# Altium schematic sheet MP28167GQ-Z_Buck-Boost Switching Regulator.SchDoc: +5 Output DC-DC Converter
size A4
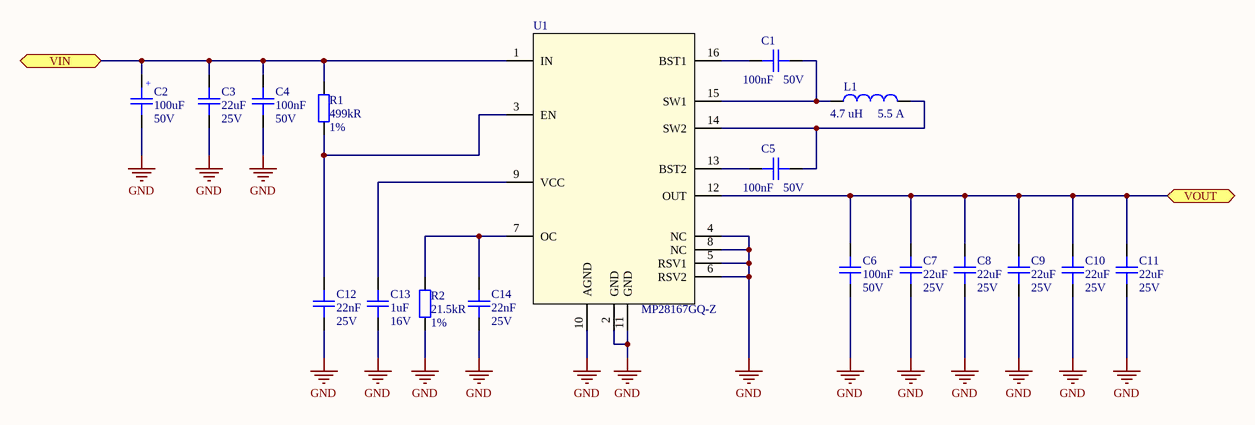
[diagram p0: MP28167GQ-Z_Buck-Boost Switching Regulator.SchDoc]

## Parts
C1  Capacitance: 100nF  Voltage: 50V  [C0402]  (hidden comment: CAP CER 0.1UF 50V X7R 0402)
C2  Capacitance: 100uF  Rated Voltage: 50V  [WCAP-ASLI_8.3X10.5]  (hidden comment: CAP ALUM 100UF 20% 50V SMD)
C3  Capacitance: 22uF  Voltage Rating: 25V  [C0805]  (hidden comment: CAP CER 22UF 25V X5R 0805)
C4  Capacitance: 100nF  Voltage: 50V  [C0402]  (hidden comment: CAP CER 0.1UF 50V X7R 0402)
C5  Capacitance: 100nF  Voltage: 50V  [C0402]  (hidden comment: CAP CER 0.1UF 50V X7R 0402)
C6  Capacitance: 100nF  Voltage: 50V  [C0402]  (hidden comment: CAP CER 0.1UF 50V X7R 0402)
C7  Capacitance: 22uF  Voltage Rating: 25V  [C0805]  (hidden comment: CAP CER 22UF 25V X5R 0805)
C8  Capacitance: 22uF  Voltage Rating: 25V  [C0805]  (hidden comment: CAP CER 22UF 25V X5R 0805)
C9  Capacitance: 22uF  Voltage Rating: 25V  [C0805]  (hidden comment: CAP CER 22UF 25V X5R 0805)
C10  Capacitance: 22uF  Voltage Rating: 25V  [C0805]  (hidden comment: CAP CER 22UF 25V X5R 0805)
C11  Capacitance: 22uF  Voltage Rating: 25V  [C0805]  (hidden comment: CAP CER 22UF 25V X5R 0805)
C12  Capacitance: 22nF  Voltage Rating: 25V  [C0402]  (hidden comment: CAP CER 0.022UF 25V X7R 0402)
C13  Capacitance: 1uF  Voltage Rating: 16V  [C0402]  (hidden comment: CAP CER 1UF 16V X5R 0402)
C14  Capacitance: 22nF  Voltage Rating: 25V  [C0402]  (hidden comment: CAP CER 0.022UF 25V X7R 0402)
L1  Inductance: 4.7 uH  Maximum DC Current: 5.5 A  [IND_WE_MAPI]  (hidden comment: FIXED IND 4.7UH 5.5A 34.5MOHM SM)
R1  Resistance: 499kR  Tolerance: 1%  [R0402]  (hidden comment: RES SMD 499K OHM 1% 1/16W 0402)
R2  Resistance: 21.5kR  Tolerance: 1%  [R0402]  (hidden comment: RES SMD 21.5K OHM 1% 1/16W 0402)
U1  MP28167GQ-Z  [QFN16_3X3]

## Ports
VIN, VOUT

## Nets
GND: C2.2 C3.1 C4.1 C6.1 C7.1 C8.1 C9.1 C10.1 C11.1 C12.1 C13.1 C14.1 R2.2 U1.2(GND) U1.4(NC) U1.5(RSV1) U1.6(RSV2) U1.8(NC) U1.10(AGND) U1.11(GND)
VIN: C2.1 C3.2 C4.2 R1.2 U1.1(IN) ; port VIN
VOUT: C6.2 C7.2 C8.2 C9.2 C10.2 C11.2 U1.12(OUT) ; port VOUT
NetC1_1: C1.1 U1.16(BST1)
NetC1_2: C1.2 L1.1 U1.15(SW1)
NetC5_1: C5.1 U1.13(BST2)
NetC5_2: C5.2 L1.2 U1.14(SW2)
NetC12_2: C12.2 R1.1 U1.3(EN)
NetC13_2: C13.2 U1.9(VCC)
NetC14_2: C14.2 R2.1 U1.7(OC)

## Notes on the sheet
- Title
- Size:
- Date:
- A4
- Number:
- Time:
- Revision:
- Sheet
- of
- File:
- (in symbol CAP ALUM 100UF 20% 50V SMD) +

## Library data of the parts
C1 C4-C6 = CAP CER 0.1UF 50V X7R 0402: 0.1µF ±10% 50V Ceramic Capacitor X7R 0402 (1005 Metric); Manufacturer: TDK; Manufacturer Part Number: CGA2B3X7R1H104K050BB; Supplier 1: Digi-Key; Stock 1: 2925303; Pricing 1: 1=0.17, 10=0.118, 50=0.0668, 100=0.0553, 500=0.0388, 1000=0.0321, 2500=0.0299, 5000=0.0273 (USD); Mount: Surface Mount; Case/Package: 0402; Weight: 2.3E-05oz; Case Code (Metric): 1005; Case Code (Imperial): 0402; Min Operating Temperature: -55°C; Max Operating Temperature: 125°C; Voltage Rating: 50V; Tolerance: 10%; Packaging: Tape and Reel; Package Quantity: 1; Voltage Rating (DC): 50V; Dielectric: X7R; Termination: SMD/SMT; Composition: Ceramic; Length: 1mm; Height: 0.5mm; Width: 0.02inch; Thickness: 0.022inch; Depth: 0.5mm; Ratings: AEC-Q200; REACH SVHC: No SVHC; Lead Free: Lead Free; ComponentLink1URL: http://product.tdk.com/capacitor/mlcc/en/documents/mlccspec_automotive_general_midvoltage_en.pdf?src-supplier=Future+Electronics; ComponentLink1Description: http://product.tdk.com/capacitor/mlcc/en/documents/mlccspec_automotive_general_midvoltage_en.pdf?src-supplier=Future+Electronics; ComponentLink2URL: http://www.farnell.com/datasheets/1807242.pdf?src-supplier=Element14; ComponentLink2Description: http://www.farnell.com/datasheets/1807242.pdf?src-supplier=Element14; ComponentLink3URL: http://www.mouser.com/ds/2/400/lcc_automotive_general_en-843974.pdf?src-supplier=Mouser; ComponentLink3Description: http://www.mouser.com/ds/2/400/lcc_automotive_general_en-843974.pdf?src-supplier=Mouser; ComponentLink4URL: http://www.farnell.com/datasheets/1936565.pdf?src-supplier=Element14; ComponentLink4Description: http://www.farnell.com/datasheets/1936565.pdf?src-supplier=Element14; ComponentLink5URL: http://www.farnell.com/datasheets/1735392.pdf?src-supplier=Element14; ComponentLink5Description: http://www.farnell.com/datasheets/1735392.pdf?src-supplier=Element14; Supplier Part Number 1: 445-6899-1-ND
C2 = CAP ALUM 100UF 20% 50V SMD: 100 µF 50 V Aluminum Electrolytic Capacitors Radial, Can - SMD - 2000 Hrs @ 105°C; Manufacturer: Wurth Elektronik; Manufacturer Part Number: 865080653016; Dissipation Factor: 10%; Endurance: 2000h; Capacitance Tolerance: +/-20%; Supplier 1: Digi-Key; Packaging: Tape and Reel; ComponentLink1URL: http://www.we-online.de; ComponentLink1Description: Manufacturer; Supplier Part Number 1: 732-8461-2-ND; Diameter: 8mm; Height: 10.5mm; ComponentLink2URL: https://www.we-online.com/catalog/datasheet/865080443009.pdf; ComponentLink2Description: Datasheet; Mounting Technology: SMT; Operating Temperature: -55 to +105degC; Published Date: May 2020; Mount: Surface Mount
C3 C7-C11 = CAP CER 22UF 25V X5R 0805: 22µF ±20% 25V Ceramic Capacitor X5R 0805 (2012 Metric); Manufacturer: Yageo; Manufacturer Part Number: CC0805MKX5R8BB226; Supplier 1: Digi-Key; Stock 1: 1060; Pricing 1: 1=0.5, 10=0.353, 50=0.267, 100=0.2325, 500=0.1722, 1000=0.1464 (USD); Mount: Surface Mount; Case/Package: 0805; Weight: 0.000194oz; Case Code (Metric): 2012; Case Code (Imperial): 0805; Min Operating Temperature: -55°C; Max Operating Temperature: 85°C; Packaging: Tape and Reel; Tolerance: 20%; Dielectric: X5R; Termination: SMD/SMT; Voltage Rating (DC): 25V; Package Quantity: 3000; Length: 0.079inch; Height: 1.25mm; Width: 0.049inch; Thickness: 0.057inch; Lead Free: Lead Free; Halogen Free: Halogen Free; ComponentLink1URL: http://www.yageo.com/documents/recent/UPY-GPHC_X5R_4V-to-50V_25.pdf?src-supplier=Digi-Key; ComponentLink1Description: http://www.yageo.com/documents/recent/UPY-GPHC_X5R_4V-to-50V_25.pdf?src-supplier=Digi-Key; ComponentLink2URL: http://www.mouser.com/ds/2/447/Yageo_UPY-GP_NP0_16V-to-50V_9-358835.pdf?src-supplier=Mouser; ComponentLink2Description: http://www.mouser.com/ds/2/447/Yageo_UPY-GP_NP0_16V-to-50V_9-358835.pdf?src-supplier=Mouser; Supplier Part Number 1: 311-1903-1-ND
C12 C14 = CAP CER 0.022UF 25V X7R 0402: 0.022µF ±10% 25V Ceramic Capacitor X7R 0402 (1005 Metric); Manufacturer: TDK; Manufacturer Part Number: CGA2B2X7R1E223K050BA; Supplier 1: Digi-Key; Stock 1: 330320; Pricing 1: 1=0.1, 10=0.057, 50=0.0312, 100=0.0255, 500=0.0182, 1000=0.0143, 2500=0.013, 5000=0.012 (USD); Mount: Surface Mount; Case/Package: 0402; Weight: 2.3E-05oz; Case Code (Imperial): 0402; Case Code (Metric): 1005; Min Operating Temperature: -55°C; Max Operating Temperature: 125°C; Voltage Rating (DC): 25V; Tolerance: 10%; Packaging: Tape and Reel; Package Quantity: 1; Dielectric: X7R; Termination: SMD/SMT; Composition: Ceramic; Length: 1mm; Height: 0.5mm; Width: 0.5mm; Thickness: 0.022inch; Depth: 0.5mm; Ratings: AEC-Q200; REACH SVHC: No SVHC; ComponentLink1URL: http://www.mouser.com/ds/2/400/lcc_automotive_general_en-843974.pdf?src-supplier=Mouser; ComponentLink1Description: http://www.mouser.com/ds/2/400/lcc_automotive_general_en-843974.pdf?src-supplier=Mouser; Supplier Part Number 1: 445-5609-1-ND
C13 = CAP CER 1UF 16V X5R 0402: 1µF ±10% 16V Ceramic Capacitor X5R 0402 (1005 Metric); Manufacturer: Yageo; Manufacturer Part Number: CC0402KRX5R7BB105; Supplier 1: Digi-Key; Stock 1: 1114963; Pricing 1: 1=0.4, 10=0.278, 100=0.167, 500=0.1253, 1000=0.1058, 2500=0.1002, 5000=0.0947 (USD); Mount: Surface Mount; Case/Package: 0402; Weight: 2.3E-05oz; Case Code (Metric): 1005; Case Code (Imperial): 0402; Min Operating Temperature: -55°C; Max Operating Temperature: 85°C; Packaging: Tape and Reel; Tolerance: 10%; Voltage Rating (DC): 16V; Dielectric: X5R; Termination: SMD/SMT; Length: 1mm; Height: 0.5mm; Width: 0.02inch; Thickness: 0.022inch; Depth: 0.5mm; Lead Free: Lead Free; ComponentLink1URL: http://www.yageo.com/documents/recent/UPY-GPHC_X5R_4V-to-50V_12.pdf?src-supplier=Avnet+Europe; ComponentLink1Description: http://www.yageo.com/documents/recent/UPY-GPHC_X5R_4V-to-50V_12.pdf?src-supplier=Avnet+Europe; Supplier Part Number 1: 311-1691-1-ND; Composition: Ceramic; Radiation Hardening: No; Halogen Free: Halogen Free
L1 = FIXED IND 4.7UH 5.5A 34.5MOHM SM: Manufacturer: Wurth Elektronik; Manufacturer Part Number: 74438367047; Self Resonant Frequency: 18.5 MHz; Shielding: Shielded; Tolerance: 20 %; RoHS: RoHS Compliant; Category: Fixed Inductors; Stock 1: 2000; Pricing 1: 1=0.730, 10=0.721, 50=0.601, 100=0.457, 1000=0.397, 2000=0.385 (USD); Application: Power; Height: 3.1 mm; Length: 5.4 mm; Maximum DC Resistance: 34.5 mOhms; Packaging: Cut Tape; Product: Fixed Inductors; Series: WE-MAPI; Termination Style: SMD/SMT; Width: 5.4 mm; Brand: Wurth Elektronik; Mounting Style: PCB Mount; Maximum Operating Temperature: + 125 C; Minimum Operating Temperature: - 40 C; Product Type: Fixed Inductors; Saturation Current: 5.5 A; Standard Pack Qty: 700; Subcategory: Inductors, Chokes & Coils; Termination: -; RoHS - Mouser: Y; Minimum Order Quantity: 1; Reeling: True; ComponentLink1URL: https://www.digikey.com/en/products/detail/würth-elektronik/74438367047/11657931?s=N4IgjCBcoMxaBjKAzAhgGwM4FMA0IB7KAbXAE4AGCkAXXwAcAXKEAZUYCcBLAOwHMQAX3wA2MvBBJIaLHkIkQAFgpkYq2g2aQ2nXgOHgATGHHRJKDDnxFIpQzHtgRGkExbtu-IfkMUAHADsElIyVvK2SgB0AQAEAK0AEi5u2gCqPFyMAPLIALLYqJgArhzY3iAAtBBmIZZyNqQBDrQGFYbBUJxF9QoArC2CgkA; ComponentLink1Description: https://www.digikey.com/en/products/detail/würth-elektronik/74438367047/11657931?s=N4IgjCBcoMxaBjKAzAhgGwM4FMA0IB7KAbXAE4AGCkAXXwAcAXKEAZUYCcBLAOwHMQAX3wA2MvBBJIaLHkIkQAFgpkYq2g2aQ2nXgOHgATGHHRJKDDnxFIpQzHtgRGkExbtu-IfkMUAHADsElIyVvK2SgB0AQAEAK0AEi5u2gCqPFyMAPLIALLYqJgArhzY3iAAtBBmIZZyNqQBDrQGFYbBUJxF9QoArC2CgkA; Supplier 2: Digi-Key; Supplier Part Number 1: 732-74438367047TR-ND; Mount: Surface Mount
R1 = RES SMD 499K OHM 1% 1/16W 0402: 499 kOhms ±1% 0.063W, 1/16W Chip Resistor 0402 (1005 Metric) Moisture Resistant Thick Film; Manufacturer: Yageo; Manufacturer Part Number: RC0402FR-07499KL; Power Rating: 62.5mW; Voltage Rating: 50V; Temperature Coefficient: 100ppm/°C; Max Power Dissipation: 63mW; Supplier 1: Digi-Key; Stock 1: 118017; Pricing 1: 1=0.1, 10=0.016, 100=0.0064, 1000=0.0029, 2500=0.0025, 5000=0.0021 (USD); Case/Package: 0402; Weight: 2.3E-05oz; Case Code (Imperial): 0402; Case Code (Metric): 1005; Min Operating Temperature: -55°C; Max Operating Temperature: 155°C; Packaging: Tape and Reel; Composition: Thick Film; Number of Terminations: 2; Termination: SMD/SMT; Military Standard: Not; Features: Moisture Resistant; Length: 1mm; Height: 0.016inch; Width: 0.02inch; Depth: 0.5mm; REACH SVHC: Unknown; Lead Free: Lead Free; ComponentLink1URL: https://www.digikey.com/en/products/detail/yageo/RC0402FR-07499KL/726622?s=N4IgTCBcDaIEoGEAMAWJYBicC0SDsKAnIQNIAyIAugL5A; ComponentLink1Description: https://www.digikey.com/en/products/detail/yageo/RC0402FR-07499KL/726622?s=N4IgTCBcDaIEoGEAMAWJYBicC0SDsKAnIQNIAyIAugL5A; Supplier Part Number 1: 311-499KLRTR-ND; Mount: Surface Mount
R2 = RES SMD 21.5K OHM 1% 1/16W 0402: 21.5 kOhms ±1% 0.063W, 1/16W Chip Resistor 0402 (1005 Metric) Moisture Resistant Thick Film; Manufacturer: Yageo; Manufacturer Part Number: RC0402FR-0721K5L; Power Rating: 62.5mW; Voltage Rating: 50V; Max Power Dissipation: 63mW; Temperature Coefficient: 100ppm/°C; Supplier 1: Digi-Key; Stock 1: 58499; Pricing 1: 1=0.1, 10=0.016, 100=0.0064, 1000=0.0029, 2500=0.0025, 5000=0.0021 (USD); Case/Package: 0402; Weight: 2.3E-05oz; Case Code (Imperial): 0402; Case Code (Metric): 1005; Contact Plating: Tin,Matte; Min Operating Temperature: -55°C; Max Operating Temperature: 155°C; Packaging: Tape and Reel; Composition: Thick Film; Number of Terminations: 2; Termination: SMD/SMT; Military Standard: Not; Voltage Rating (DC): 50V; Features: Moisture Resistant; Length: 1mm; Height: 0.016inch; Width: 0.02inch; Depth: 0.5mm; Radiation Hardening: No; Lead Free: Lead Free; ComponentLink1URL: https://www.digikey.com/en/products/detail/yageo/RC0402FR-0721K5L/2827630?s=N4IgTCBcDaIEoGEAMAWJYBicC0SDsYAjANICsAMiALoC%2BQA; ComponentLink1Description: https://www.digikey.com/en/products/detail/yageo/RC0402FR-0721K5L/2827630?s=N4IgTCBcDaIEoGEAMAWJYBicC0SDsYAjANICsAMiALoC%2BQA; Supplier Part Number 1: 311-21.5KLRTR-ND; Mount: Surface Mount
U1 = IC MP28167GQ-Z 2.8V-22V VIN, 3A IOUT, 4-SWITCH: Buck-Boost Switching Regulator IC Positive Fixed 5V 1 Output 3A 16-PowerVFQFN; Manufacturer: Monolithic Power Systems Inc.; Product Status: New Product; Supplier 1: Mouser; Manufacturer Part Number: MP28167GQ-Z; RoHS: RoHS Compliant; Category: PMIC - Voltage Regulators - DC DC Switching Regulators; Stock 1: 208; Pricing 1: 1=4.41, 10=3.96, 100=3.34, 250=2.91, 500=2.76, 1000=2.33, 2500=2.21, 5000=2.13 (USD); Packaging: Cut Tape; Brand: Monolithic Power Systems Inc.; Standard Pack Qty: 5000; Subcategory: PMIC - Voltage Regulators - DC DC Switching Regulators; Minimum Order Quantity: 1; ComponentLink1URL: https://www.monolithicpower.com/en/documentview/productdocument/index/version/2/document_type/Datasheet/lang/en/sku/MP28167GQ/document_id/4000/; ComponentLink1Description: Data sheet; Supplier Part Number 1: 1589-MP28167GQ-ZTR-ND; Mount: Surface Mount